# Altium schematic sheet PWM&CAN&SD.SchDoc
size A4
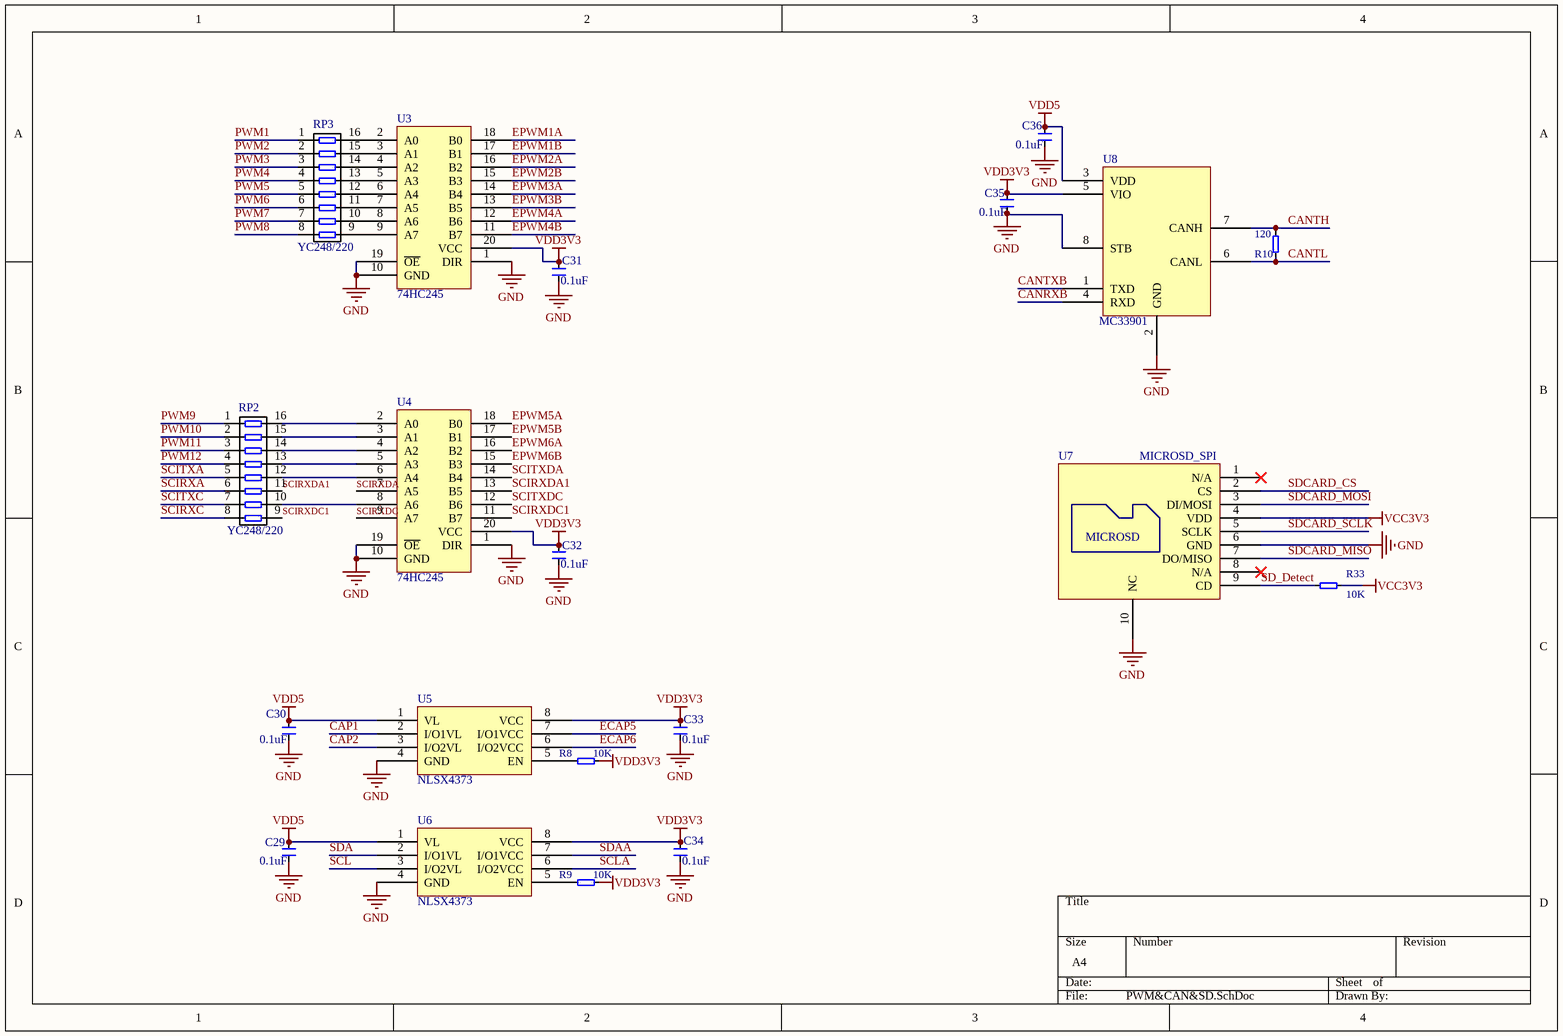
[diagram p0: PWM&CAN&SD.SchDoc]

## Parts
C29  0.1uF  [0603C]
C30  0.1uF  [0603C]
C31  0.1uF  [0603C]
C32  0.1uF  [0603C]
C33  0.1uF  [0603C]
C34  0.1uF  [0603C]
C35  0.1uF  [0603C]
C36  0.1uF  [0603C]
R8  10K  [0603R]
R9  10K  [0603R]
R10  120  [0603R]
R33  10K  [0603R]
RP2  YC248/220  [YC248(0603x8)]
RP3  YC248/220  [YC248(0603x8)]
U3  74HC245  [TSSOP20]
U4  74HC245  [TSSOP20]
U5  NLSX4373  [UDFN8]
U6  NLSX4373  [UDFN8]
U7  MICROSD_SPI  [microsd]
U8  MC33901  [SOIC-8]

## Nets
GND: C29.1 C30.1 C31.1 C32.1 C33.1 C34.1 C35.1 C36.1 U3.1(DIR) U3.10(GND) U3.19(~{OE}) U4.1(DIR) U4.10(GND) U4.19(~{OE}) U5.4(GND) U6.4(GND) U7.6(GND) U7.10(NC) U8.2(GND) U8.8(STB)
VCC3V3: R33.1 U7.4(VDD)
VDD3V3: C31.2 C32.2 C33.2 C34.2 C35.2 R8.2 R9.2 U3.20(VCC) U4.20(VCC) U5.8(VCC) U6.8(VCC) U8.5(VIO)
VDD5: C29.2 C30.2 C36.2 U5.1(VL) U6.1(VL) U8.3(VDD)
CANRXB: U8.4(RXD)
CANTH: R10.1 U8.7(CANH)
CANTL: R10.2 U8.6(CANL)
CANTXB: U8.1(TXD)
CAP1: U5.2(I/O1VL)
CAP2: U5.3(I/O2VL)
ECAP5: U5.7(I/O1VCC)
ECAP6: U5.6(I/O2VCC)
EPWM1A: U3.18(B0)
EPWM1B: U3.17(B1)
EPWM2A: U3.16(B2)
EPWM2B: U3.15(B3)
EPWM3A: U3.14(B4)
EPWM3B: U3.13(B5)
EPWM4A: U3.12(B6)
EPWM4B: U3.11(B7)
EPWM5A: U4.18(B0)
EPWM5B: U4.17(B1)
EPWM6A: U4.16(B2)
EPWM6B: U4.15(B3)
PWM1: RP3.1
PWM2: RP3.2
PWM3: RP3.3
PWM4: RP3.4
PWM5: RP3.5
PWM6: RP3.6
PWM7: RP3.7
PWM8: RP3.8
PWM9: RP2.1
PWM10: RP2.2
PWM11: RP2.3
PWM12: RP2.4
SCIRXA: RP2.6
SCIRXC: RP2.8
SCIRXDA: U4.7(A5)
SCIRXDA1: RP2.11 U4.13(B5)
SCIRXDC: U4.9(A7)
SCIRXDC1: RP2.9 U4.11(B7)
SCITXA: RP2.5
SCITXC: RP2.7
SCITXDA: U4.14(B4)
SCITXDC: U4.12(B6)
SCL: U6.3(I/O2VL)
SCLA: U6.6(I/O2VCC)
SD_Detect: R33.2 U7.9(CD)
SDA: U6.2(I/O1VL)
SDAA: U6.7(I/O1VCC)
SDCARD_CS: U7.2(CS)
SDCARD_MISO: U7.7(DO/MISO)
SDCARD_MOSI: U7.3(DI/MOSI)
SDCARD_SCLK: U7.5(SCLK)
NetR8_1: R8.1 U5.5(EN)
NetR9_1: R9.1 U6.5(EN)
NetRP2_10: RP2.10 U4.8(A6)
NetRP2_12: RP2.12 U4.6(A4)
NetRP2_13: RP2.13 U4.5(A3)
NetRP2_14: RP2.14 U4.4(A2)
NetRP2_15: RP2.15 U4.3(A1)
NetRP2_16: RP2.16 U4.2(A0)
NetRP3_9: RP3.9 U3.9(A7)
NetRP3_10: RP3.10 U3.8(A6)
NetRP3_11: RP3.11 U3.7(A5)
NetRP3_12: RP3.12 U3.6(A4)
NetRP3_13: RP3.13 U3.5(A3)
NetRP3_14: RP3.14 U3.4(A2)
NetRP3_15: RP3.15 U3.3(A1)
NetRP3_16: RP3.16 U3.2(A0)

Not connected (* = marked no-connect by the designer): U7 1(N/A)* 8(N/A)*

## Notes on the sheet
- (in symbol MICROSD_SPI) MICROSD

## Library data of the parts
C29-C36 = C
R8-R10 R33 = R
RP2 RP3 = RP